# Altium schematic sheet switches.SchDoc
size A
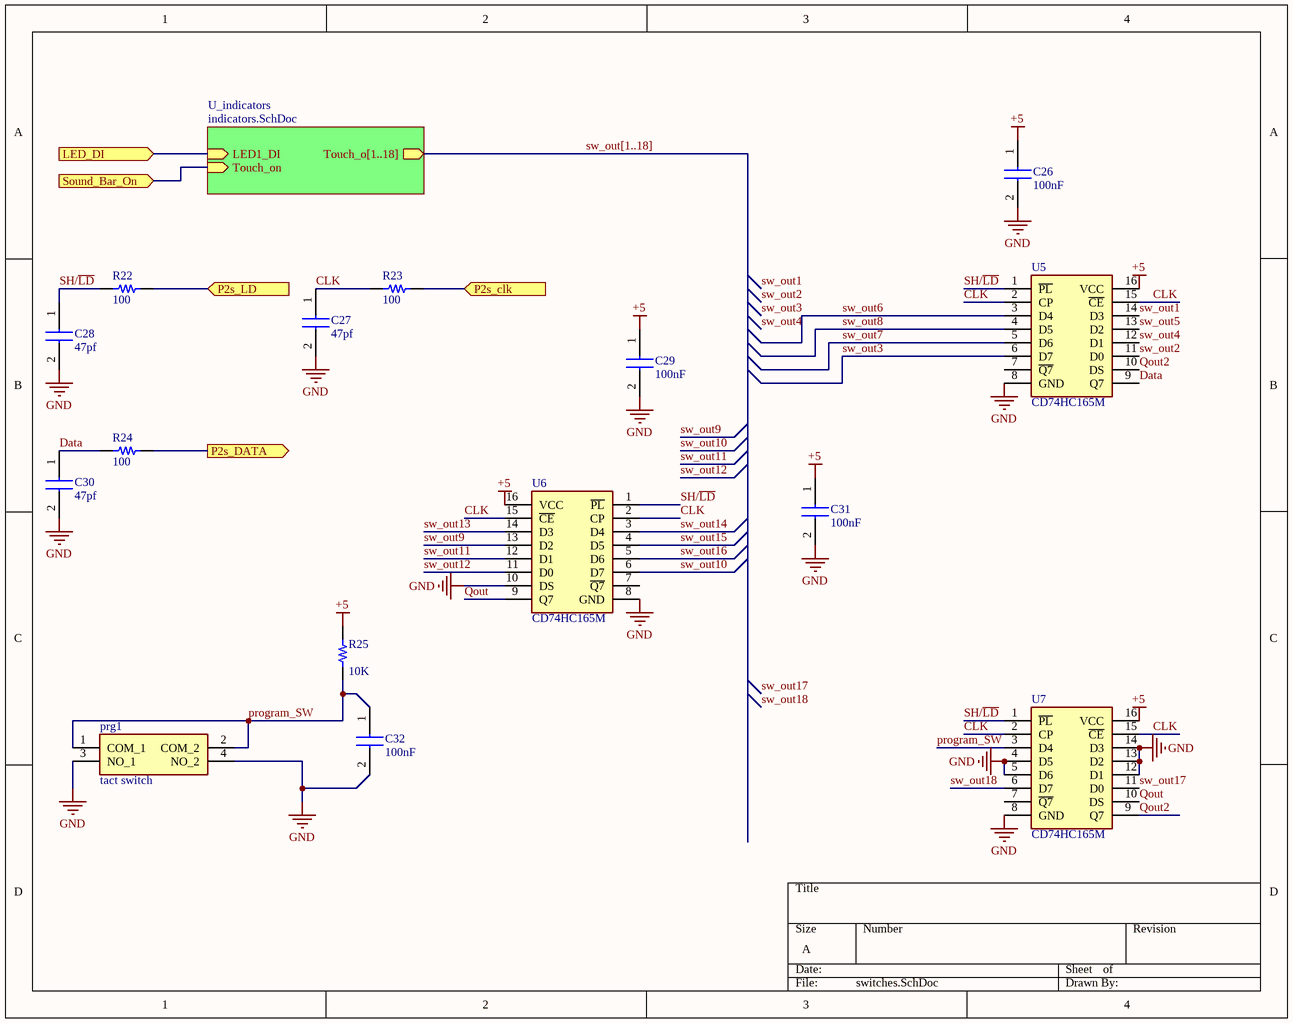
[diagram p0: switches.SchDoc]

## Parts
C26  100nF  [0603C]
C27  47pf  [0603C]
C28  47pf  [0603C]
C29  100nF  [0603C]
C30  47pf  [0603C]
C31  100nF  [0603C]
C32  100nF  [0603C]
prg1  tact switch  [DTSM63NVB]
R22  100  [0603R]
R23  100  [0603R]
R24  100  [RES1206 _(3216X08L)]
R25  10K  [0603R]
U5  CD74HC165M  [SOIC127P600X175-16N]
U6  CD74HC165M  [SOIC127P600X175-16N]
U7  CD74HC165M  [SOIC127P600X175-16N]

## Sub-sheets
U_indicators = indicators.SchDoc: LED1_DI (in), Touch_o[1..18] (out), Touch_on (in)

## Ports
LED_DI (in), P2s_clk (in), P2s_DATA (out), P2s_LD (in), Sound_Bar_On (in)

## Nets
+5: C26.1 C29.1 C31.1 R25.2 U5.16(VCC) U6.16(VCC) U7.16(VCC)
GND: C26.2 C27.2 C28.2 C29.2 C30.2 C31.2 C32.2 prg1.3(NO_1) prg1.4(NO_2) U5.8(GND) U6.8(GND) U6.10(DS) U7.4(D5) U7.5(D6) U7.8(GND) U7.12(D1) U7.13(D2) U7.14(D3)
CLK: C27.1 R23.2 U5.2(CP) U5.15(~{CE}) U6.2(CP) U6.15(~{CE}) U7.2(CP) U7.15(~{CE})
Data: C30.1 R24.2 U5.9(Q7)
LED_DI: port LED_DI, sheet U_indicators/LED1_DI
P2s_clk: R23.1 ; port P2s_clk
P2s_DATA: R24.1 ; port P2s_DATA
P2s_LD: R22.1 ; port P2s_LD
program_SW: C32.1 prg1.1(COM_1) prg1.2(COM_2) R25.1 U7.3(D4)
Qout: U6.9(Q7) U7.10(DS)
Qout2: U5.10(DS) U7.9(Q7)
SH/~{LD}: C28.1 R22.2 U5.1(~{PL}) U6.1(~{PL}) U7.1(~{PL})
Sound_Bar_On: port Sound_Bar_On, sheet U_indicators/Touch_on
sw_out1: U5.14(D3)
sw_out2: U5.11(D0)
sw_out3: U5.6(D7)
sw_out4: U5.12(D1)
sw_out5: U5.13(D2)
sw_out6: U5.3(D4)
sw_out7: U5.5(D6)
sw_out8: U5.4(D5)
sw_out9: U6.13(D2)
sw_out10: U6.6(D7)
sw_out11: U6.12(D1)
sw_out12: U6.11(D0)
sw_out13: U6.14(D3)
sw_out14: U6.3(D4)
sw_out15: U6.4(D5)
sw_out16: U6.5(D6)
sw_out17: U7.11(D0)
sw_out18: U7.6(D7)

Not connected (* = marked no-connect by the designer): U5 7(~{Q7}); U6 7(~{Q7}); U7 7(~{Q7})

## Buses and harness runs
bus sw_out[1..18] = sheet U_indicators/Touch_o[1..18]

## Notes on the sheet
- Labels drawn without touching a wire or pin: sw_out1, sw_out2, sw_out3, sw_out4, sw_out17, sw_out18

## Library data of the parts
C26-C32 = C1206C104Z5UACTU: 100 nF Ceramic capacitor; Manufacturer_Name: Kemet; Datasheet Link: https://componentsearchengine.com/Datasheets/1/C1206C104Z5UACTU.pdf; Height: 0.88mm; Manufacturer_Part_Number: C1206C104Z5UACTU; Mouser Part Number: 80-C1206C104Z5U; Mouser Price/Stock: https://www.mouser.com/Search/Refine.aspx?Keyword=80-C1206C104Z5U
prg1 = DTSM-66R-V-T_R: Push Button SMD - 4PIN; Manufacturer_Name: Diptronics; Manufacturer_Part_Number: DTSM-66R-V-T/R; Datasheet Link: https://www.mouser.co.uk/datasheet/2/910/464_DTSMJ-6-1571536.pdf; Height: 7.1mm; Mouser Part Number: 113-DTSM66RVTR; Mouser Price/Stock: https://www.mouser.co.uk/ProductDetail/Diptronics/DTSM-66R-V-T-R?qs=MLItCLRbWsxl2%252BVY862AIw%3D%3D
R22-R24 = CRCW080510K0JNEAIF: RES SMD 10K OHM 5% 1/8W 0805; Manufacturer: Vishay Dale; Power (Watts): 0.125W, 1/8W; Resistance: 10 kOhms; Temperature Coefficient: ±200ppm/°C; Part Number: CRCW080510K0JNEAIF; Value: 100; ComponentLink1Description: Datasheet; ComponentLink1URL: http://www.vishay.com/docs/20024/dcrcwife3.pdf; ComponentLink2Description: DigiKey Link; ComponentLink2URL: http://digikey.com/product-detail/en/vishay-dale/CRCW080510K0JNEAIF/541-10KAPCT-ND/3477322; Composition: Thick Film; Device Package: 0805 (2012 Metric); Features: Automotive AEC-Q200, Pulse Withstanding; Height - Seated (Max): 0.020" (0.50mm); LastUpdated: 9/2/2020 1:14:55 AM; Lifecycle Status: Active; Minimum Order: 1; Number of Terminations: 2; Operating Temperature: -55°C ~ 155°C; Package / Case: 0805 (2012 Metric); Packaging: TapeAndReel; PartId: 40891; Part Status: Active; Price: 0.08; Ratings: AEC-Q200; Series: CRCW-IF; Size / Dimension: 0.079" L x 0.049" W (2.00mm x 1.25mm); Supplier 1: DigiKey; Supplier Part Number 1: 541-10KAPCT-ND; Supplier Device Package: 0805; Tolerance: ±5%
R25 = Resistor: RES SMD 0603; Part Number: RCS0805100KFKEA; Value: 10K
U5-U7 = CD74HC165M: Integrated Circuit; Manufacturer_Name: Texas Instruments; Datasheet Link: http://www.ti.com/lit/ds/symlink/cd74hc165.pdf; Height: 1.75mm; Manufacturer_Part_Number: CD74HC165M; Mouser Part Number: 595-CD74HC165M; Mouser Price/Stock: https://www.mouser.co.uk/ProductDetail/Texas-Instruments/CD74HC165M?qs=EIjG%252BN7kn%252BnD8dKZ7mdfJA%3D%3D; Arrow Part Number: CD74HC165M; Arrow Price/Stock: https://www.arrow.com/en/products/cd74hc165m/texas-instruments?region=nac